# EAGLE design tdt_switch (EAGLE 8.1.0)
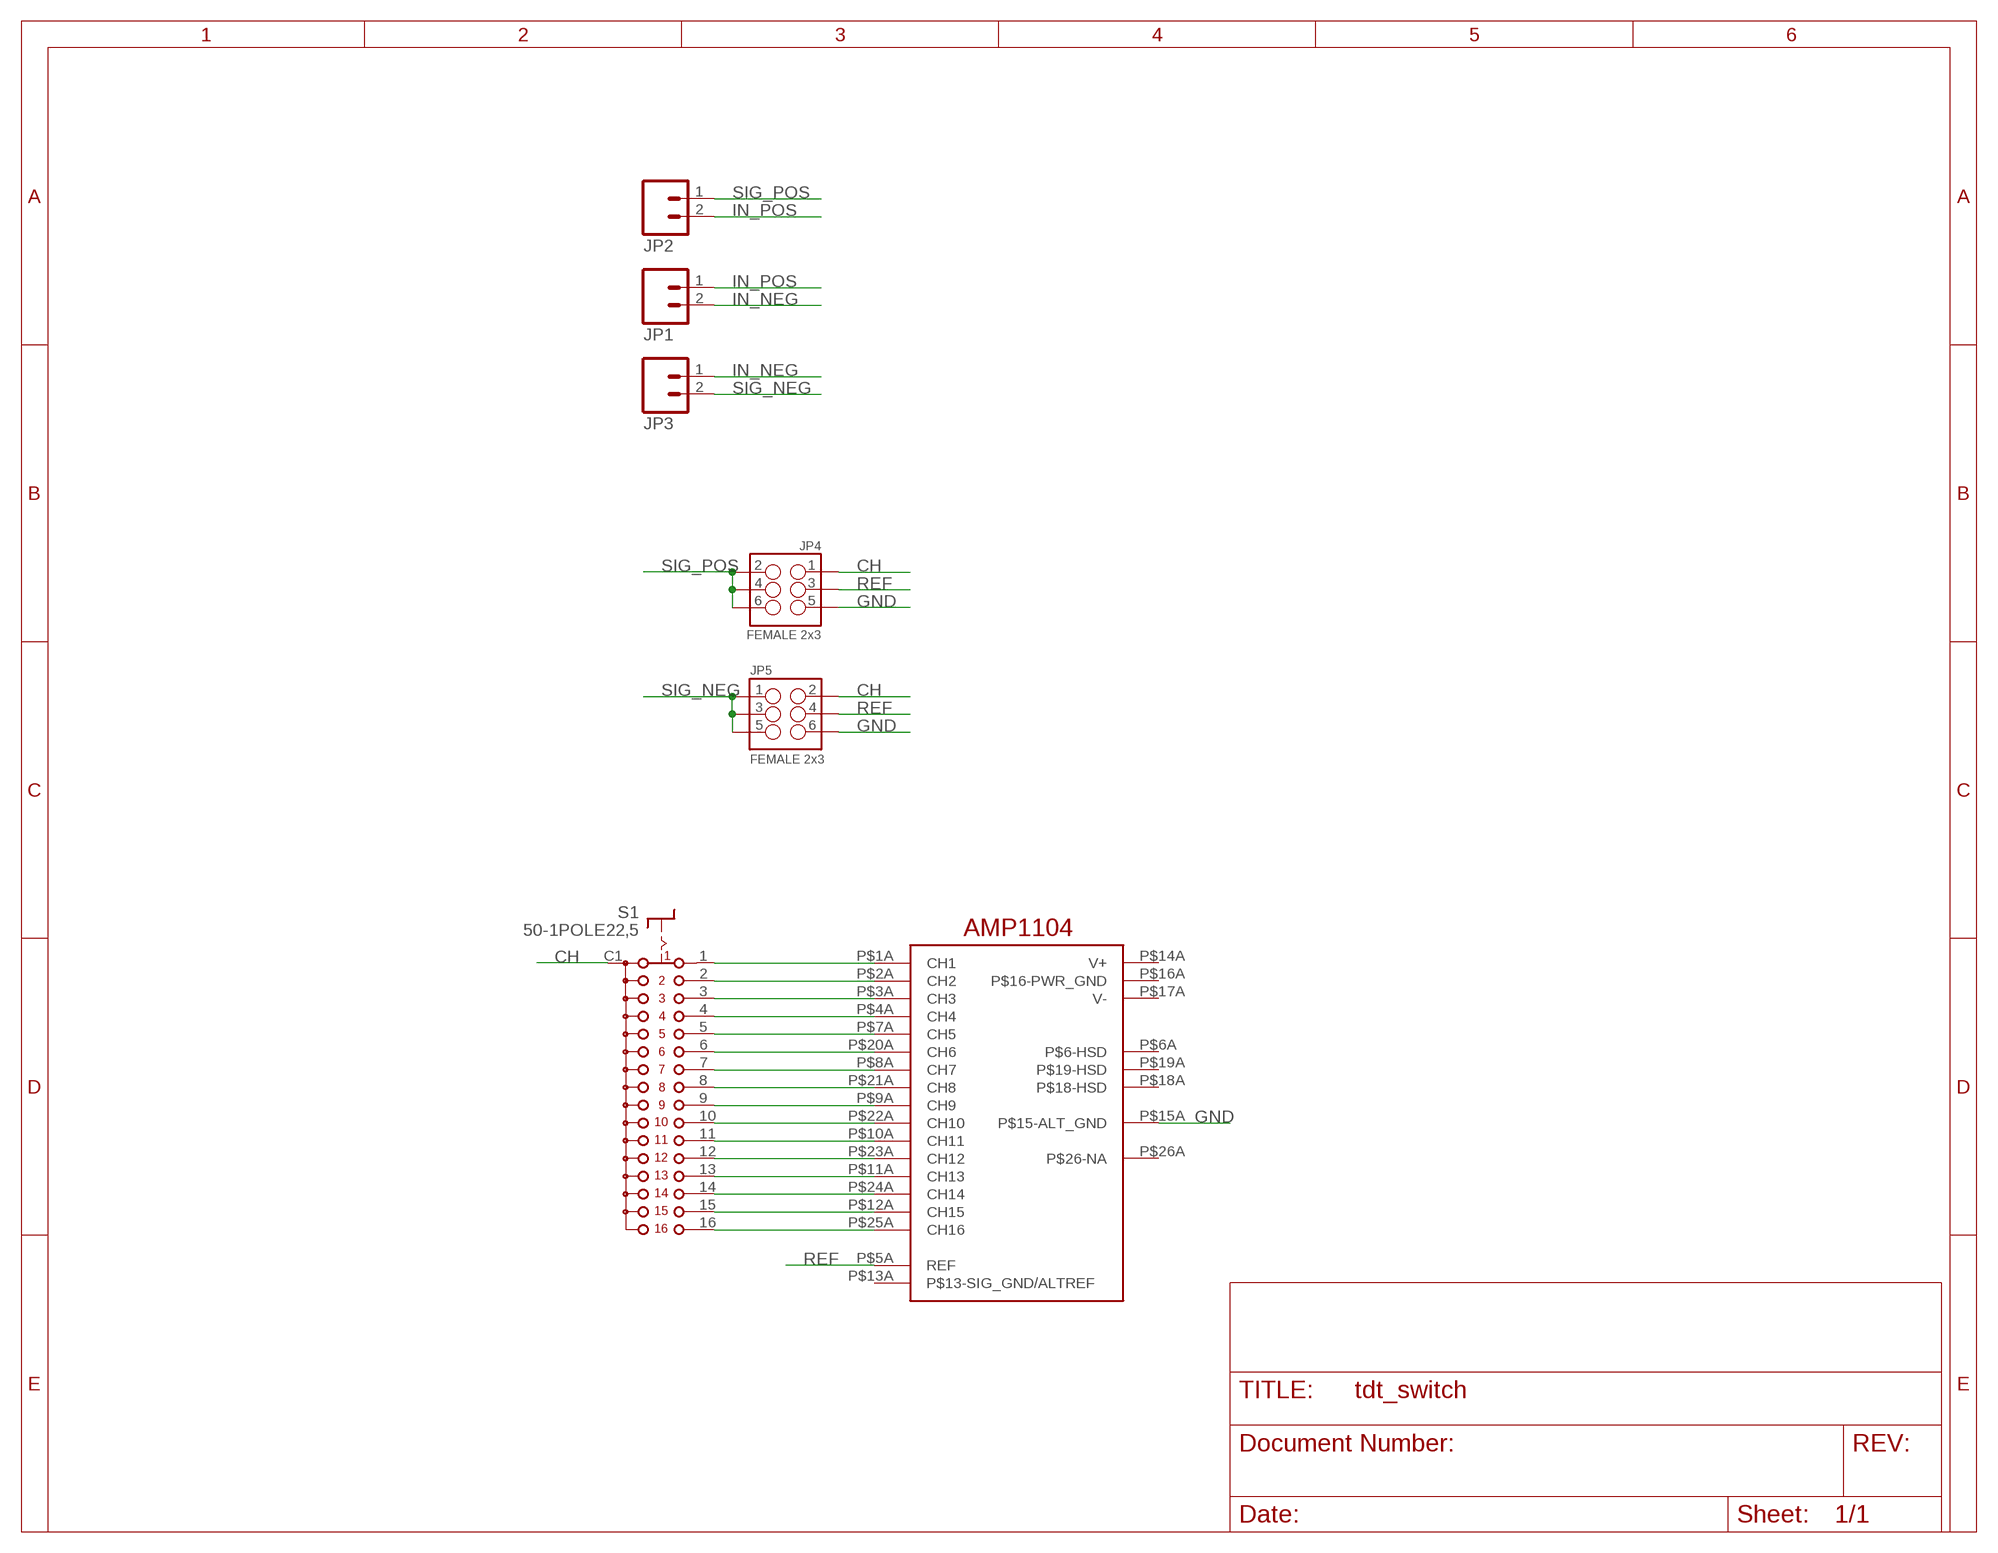
[diagram p0: schematic, sheet 1]

## Parts
JP1  M02PTH  [1X02]
JP2  M02PTH  [1X02]
JP3  M02PTH  [1X02]
JP4  FEMALE 2x3  M03X2FEMALE  [2X3]
JP5  FEMALE 2x3  M03X2FEMALE  [2X3]
S1  50-1POLE22,5  [50-1POLE22,5]
U$3  AMP1104  [AMP1104]

## Nets
CH: JP4.1 JP5.2 S1.C1(C)
GND: JP4.5 JP5.6 U$3.P$15A(P$15-ALT_GND)
IN_NEG: JP1.2 JP3.1
IN_POS: JP1.1 JP2.2
N$1: S1.1 U$3.P$1A(CH1)
N$2: S1.2 U$3.P$2A(CH2)
N$3: S1.3 U$3.P$3A(CH3)
N$4: S1.4 U$3.P$4A(CH4)
N$5: S1.5 U$3.P$7A(CH5)
N$6: S1.6 U$3.P$20A(CH6)
N$7: S1.7 U$3.P$8A(CH7)
N$8: S1.8 U$3.P$21A(CH8)
N$9: S1.9 U$3.P$9A(CH9)
N$10: S1.10 U$3.P$22A(CH10)
N$11: S1.11 U$3.P$10A(CH11)
N$12: S1.12 U$3.P$23A(CH12)
N$13: S1.13 U$3.P$11A(CH13)
N$14: S1.14 U$3.P$24A(CH14)
N$15: S1.15 U$3.P$12A(CH15)
N$16: S1.16 U$3.P$25A(CH16)
REF: JP4.3 JP5.4 U$3.P$5A(REF)
SIG_NEG: JP3.2 JP5.1 JP5.3 JP5.5
SIG_POS: JP2.1 JP4.2 JP4.4 JP4.6
Unconnected: U$3.P$6A(P$6-HSD) U$3.P$13A(P$13-SIG_GND/ALTREF) U$3.P$14A(V+) U$3.P$16A(P$16-PWR_GND) U$3.P$17A(V-) U$3.P$18A(P$18-HSD) U$3.P$19A(P$19-HSD) U$3.P$26A(P$26-NA)

## Library data of the parts
JP1-JP3 = SparkFun-Connectors:M02: Standard 2-pin 0.1" header. Use with - straight break away headers ( PRT-00116) - right angle break away headers (PRT-00553) - swiss pins (PRT-00743) - machine pins (PRT-00117) - female headers (PRT-00115) Molex polarized connector foot print use with: PRT-08233 with associated crimp pins and housings. 2.54_SCREWTERM for use with PRT-10571. 3.5mm Screw Terminal footprints for PRT-08084 5mm Screw Terminal footprints for use with PRT-08432
JP4 JP5 = SparkFun-Connectors:M03X2: 2x3 .1" header. Shrouded, with keying- CONN-10681 SMT- CONN-11415 Pogo pins- HW-11044; PROD_ID: CONN-11566
S1 = switch:50-1POLE22,5: SERIES 50 Single-Deck Rotary Switches one pole 22.5° Source: www.grayhill.com .. J-15-21.pdf
U$3 = TDTCableConnector:AMP1104

## Board
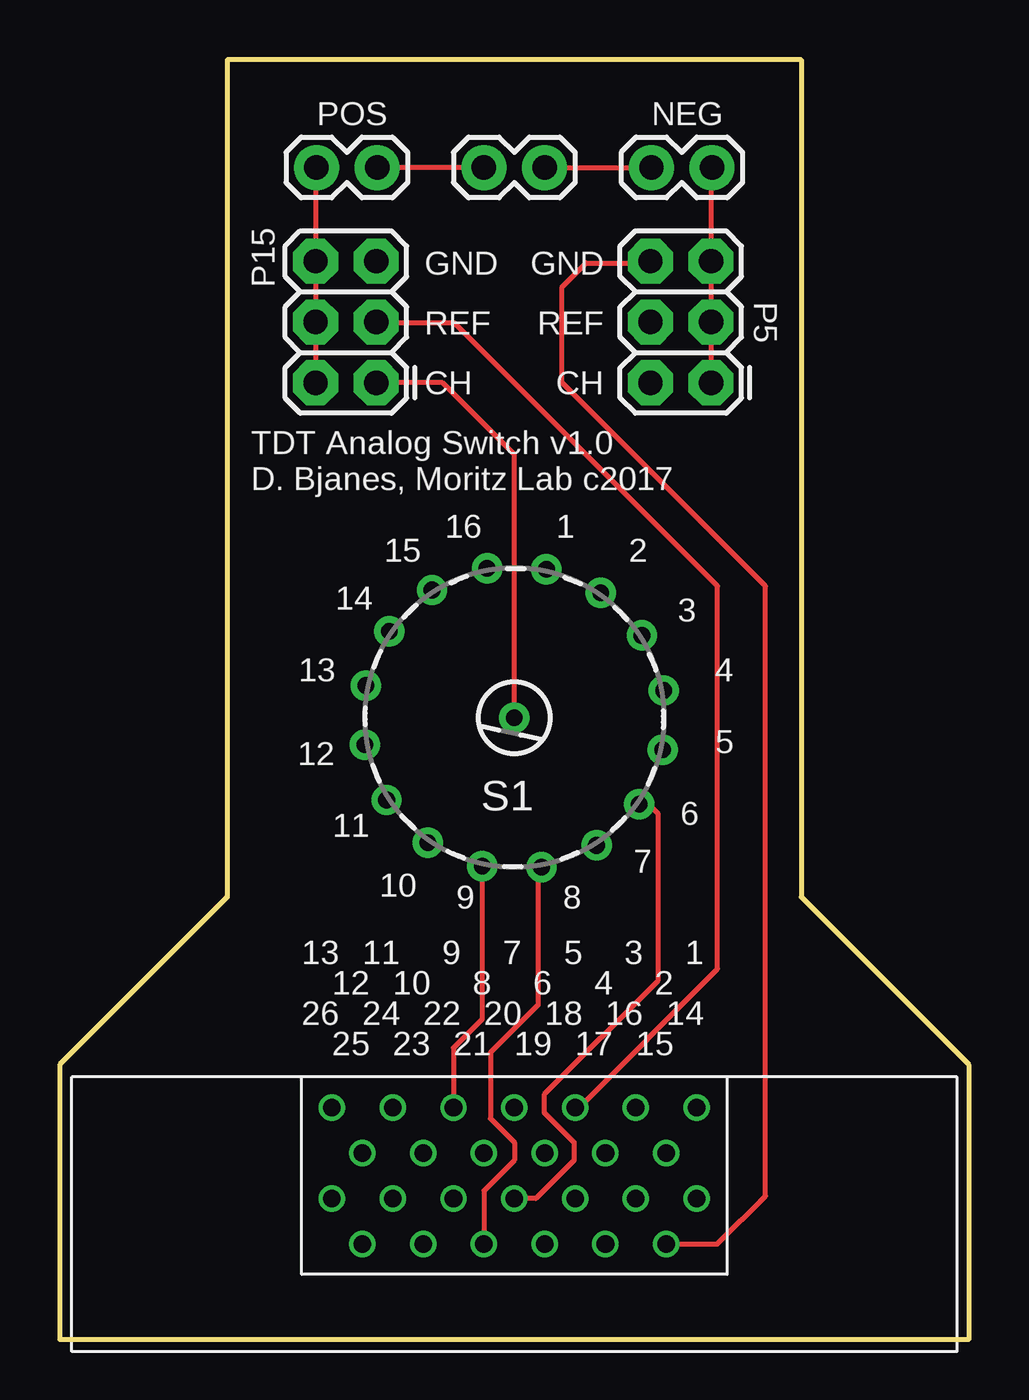
[diagram p1: board, top side]
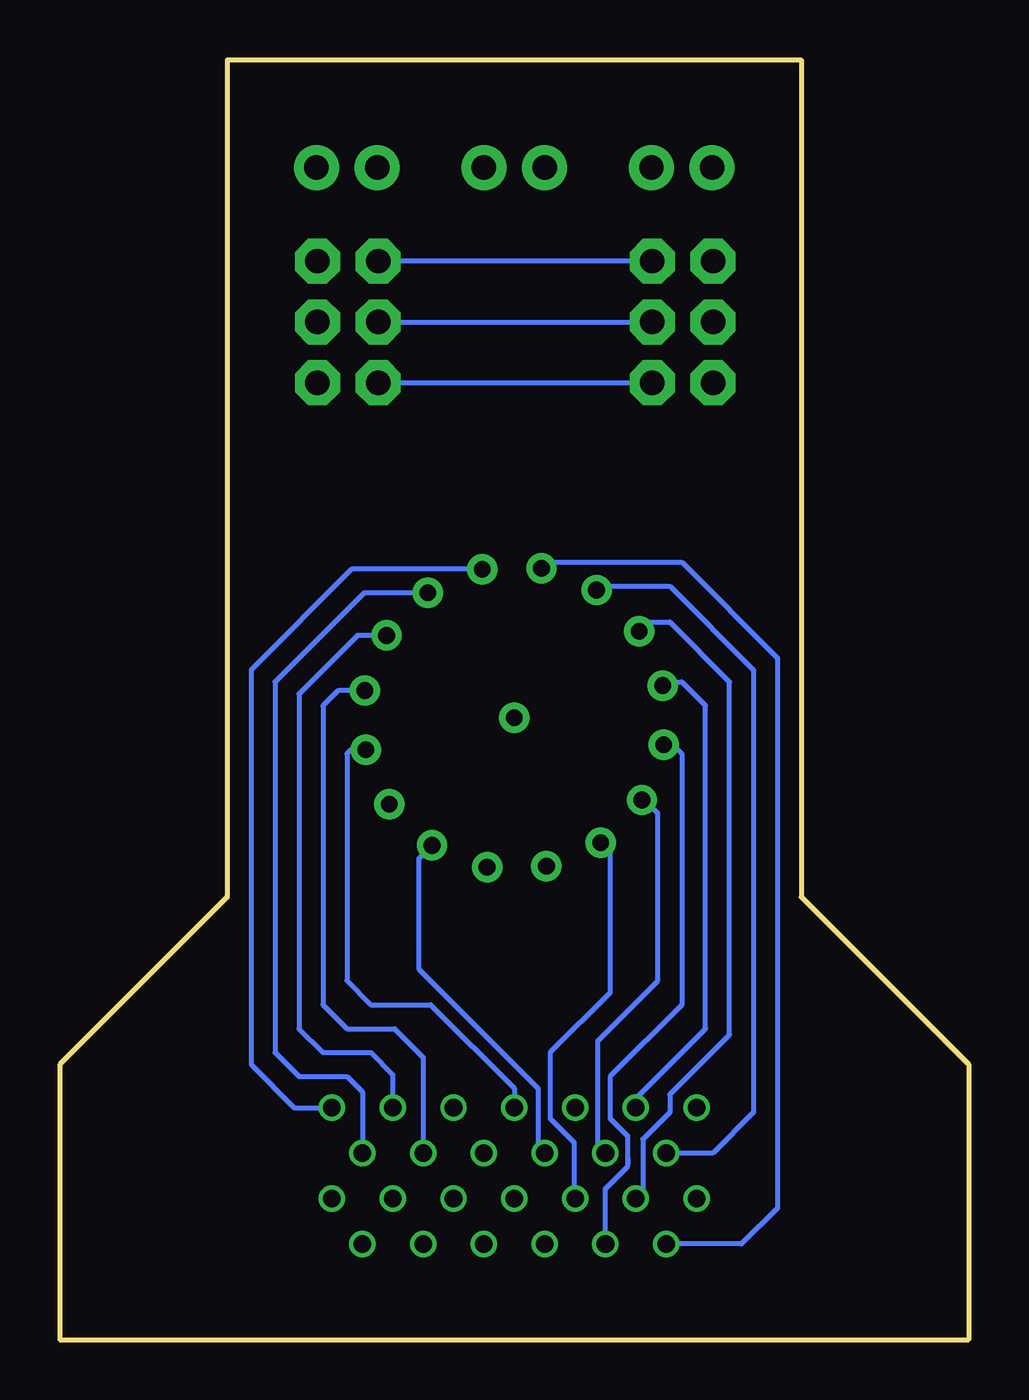
[diagram p2: board, bottom side, seen from below]

Size 38 x 53.5 mm. Coordinates in mm from the lower left corner, seen from the top.
Outline: 31,53.5 7,53.5 7,18.5 0,11.5 0,0 38,0 38,11.5 31,18.5 31,53.5
Copper layers (1*16): Top 0.0356mm / dielectric 1.5011mm / Bottom 0.0356mm
Design rules "oshpark-2layer": minimum track width 6mil, minimum drill 13mil, track to track 6mil, track to pad 6mil, pad to pad 6mil, via to via 6mil, smd to smd 6mil, copper to edge 15mil, drill to drill 6mil, minimum pad ring 7mil, minimum via ring 7mil, stop-mask expansion 2.5mil, vias tented up to drill 0mil, thermal gap 10mil

### Footprints (pad centres in the part's own frame; a part is rotated, then mirrored left to right if it is on the bottom)
1X02 = drill 1.016 pad 1.88: 1 0,0; 2 2.54,0
2X3 = drill 1.016 pad 1.88 octagon: 1 0,0; 2 0,2.54; 3 2.54,0; 4 2.54,2.54; 5 5.08,0; 6 5.08,2.54
50-1POLE22,5 = drill 0.7 pad 1.27: 1 6.207,-1.342; 2 5.221,-3.615; 3 3.44,-5.338; 4 1.135,-6.248; 5 -1.342,-6.207; 6 -3.615,-5.221; 7 -5.338,-3.44; 8 -6.248,-1.135; 9 -6.207,1.342; 10 -5.221,3.615; 11 -3.44,5.338; 12 -1.135,6.248; 13 1.342,6.207; 14 3.615,5.221; 15 5.338,3.44; 16 6.248,1.135; C1 0,0
AMP1104 = drill 0.737 pad 1.092: P$1A -7.62,-5.7; P$2A -6.35,-3.8; P$3A -5.08,-5.7; P$4A -3.81,-3.8; P$5A -2.54,-5.7; P$6A -1.27,-3.8; P$7A 0,-5.7; P$8A 1.27,-3.8; P$9A 2.54,-5.7; P$10A 3.81,-3.8; P$11A 5.08,-5.7; P$12A 6.35,-3.8; P$13A 7.62,-5.7; P$14A -7.62,-1.9; P$15A -6.35,0; P$16A -5.08,-1.9; P$17A -3.81,0; P$18A -2.54,-1.9; P$19A -1.27,0; P$20A 0,-1.9; P$21A 1.27,0; P$22A 2.54,-1.9; P$23A 3.81,0; P$24A 5.08,-1.9; P$25A 6.35,0; P$26A 7.62,-1.9

### Placement (x,y rotation side)
JP1  17.73,49 0 top
JP2  10.73,49 0 top
JP3  24.73,49 0 top
JP4  13.23,40 90 top
JP5  27.23,40 90 top
S1  19,26 90 top
U$3  19,4 180 top

### Tracks (layer width: path | path; a pad name or v marks a point on that pad's centre or on a via)
CH
  Top 0.203: S1.C1 19,37 16,40 JP4.1
  Bottom 0.203: JP5.2 JP4.1
GND
  Top 0.203: U$3.P$15A 27.5,4 29.5,6 29.5,31.5 21,40 21,44 22,45 24.61,45 JP5.6
  Bottom 0.203: JP4.5 JP5.6
IN_NEG
  Top 0.203: JP1.2 JP3.1
IN_POS
  Top 0.203: JP1.1 JP2.2
N$1
  Bottom 0.203: S1.1 25.79,32.21 30,28 30,11.5 28.2,9.7 U$3.P$1A
N$2
  Bottom 0.203: S1.2 25.28,31.22 29,27.5 29,12 28,11 26,11 25.35,10.35 U$3.P$2A
N$3
  Bottom 0.203: S1.3 25.56,29.44 28,27 28,13 27,12 25,12 24.08,11.08 U$3.P$3A
N$4
  Bottom 0.203: S1.4 26.36,27.14 27,26.5 27,14 26,13 24,13 22.81,11.81 U$3.P$4A
N$5
  Bottom 0.203: S1.5 25.84,24.66 26,24.5 26,15 25,14 22.5,14 19,10.5 U$3.P$7A
N$6
  Top 0.203: S1.6 24.61,22.39 25,22 25,15 20.25,10.25 20.25,9.5 21.5,8.25 21.5,7.5 19.9,5.9 U$3.P$20A
N$7
  Bottom 0.203: S1.7 23,20.1 23,15.5 18,10.5 18,8.07 U$3.P$8A
N$8
  Top 0.203: S1.8 20,19.62 20,14 18,12 18,9.25 19,8.25 19,7.5 17.73,6.23 U$3.P$21A
N$9
  Top 0.203: S1.9 17.66,13.4 16.46,12.2 U$3.P$9A
N$10
  Bottom 0.203: S1.10 15.28,20.78 15,20.5 15,14.5 17.5,12 17.5,9.25 16.5,8.25 16.5,5.94 U$3.P$22A
N$11
  Bottom 0.203: S1.11 13.56,22.56 13,22 13,15 15.5,12.5 15.5,8.11 U$3.P$10A
N$12
  Bottom 0.203: S1.12 12.37,24.86 12,24.5 12,14 15,11 15,9.25 14.26,8.51 14.26,7.34 14.25,7.6 14.25,7.25 15.19,6.31 U$3.P$23A
N$13
  Bottom 0.203: S1.13 12.63,27.5 12,27.5 11,26.5 11,13 13.92,10.08 U$3.P$11A
N$14
  Bottom 0.203: S1.14 13.39,30 12.5,30 10,27.5 10,12.75 12.5,10.25 12.5,9.5 13.62,8.38 13.62,6.2 U$3.P$24A
N$15
  Bottom 0.203: S1.15 15.4,31.5 12.5,31.5 9,28 9,9.5 10.7,7.8 U$3.P$12A
N$16
  Bottom 0.203: S1.16 17.61,32.5 12,32.5 8,28.5 8,5.5 9.5,4 U$3.P$25A
REF
  Top 0.203: U$3.P$5A 21.7,9.7 27.5,15.5 27.5,31.5 16.5,42.5 13.27,42.5 JP4.3
  Bottom 0.203: JP5.4 JP4.3
SIG_NEG
  Top 0.203: JP3.2 27.23,48.96 JP5.5 JP5.3 JP5.1
SIG_POS
  Top 0.203: JP2.1 10.69,48.96 JP4.6 JP4.4 JP4.2

### Text on the board
tNames: POS | NEG | GND | P15 | GND | REF | P5 | REF | CH | CH | TDT Analog Switch v1.0 / D. Bjanes, Moritz Lab c2017 | 16 | 1 | 15 | 2 | 14 | 3 | 13 | 4 | 12 | 5 | 6 | 11 | 7 | 10 | 9 | 8